# EAGLE design doorbell-hardware (EAGLE 7.1.0)
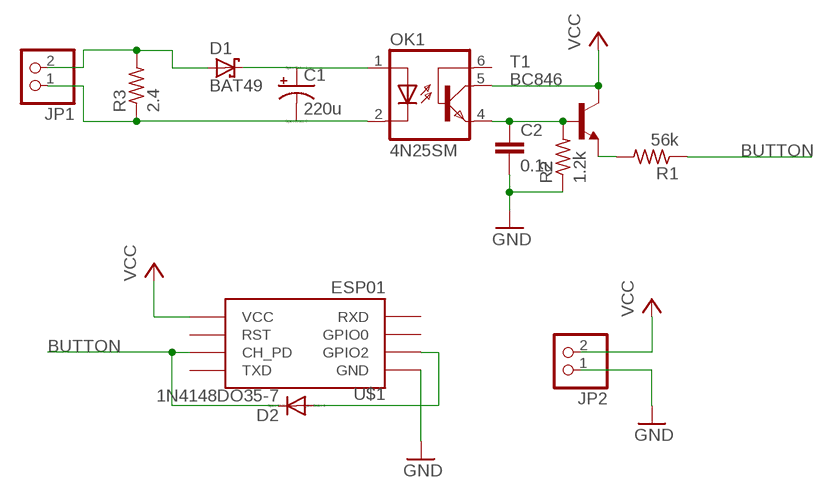
[diagram p0: schematic, sheet 1]

## Parts
C1  220u  CPOL-USE2-4  [E2-4]
C2  0.1u  C2.5/2  [C2.5-2]
D1  BAT49  [DO41-10]
D2  1N4148DO35-7  [DO35-7]
JP1  PINHD-1X2  [1X02]
JP2  PINHD-1X2  [1X02]
OK1  4N25SM  [DIL6-SMD]
R1  56k  R-US_0204/5  [0204/5]
R2  1.2k  R-US_0204/5  [0204/5]
R3  2.4  R-US_0613/15  [P0613/15]
T1  BC846  [SOT23]
U$1  ESP01  [ESP01]

## Nets
BUTTON: D2.C R1.1 U$1.CH_PD
GND: C2.2 JP2.1 R2.1 U$1.GND
N$1: D1.A JP1.2 R3.2
N$2: R1.2 T1.2(E)
N$3: C1.+ D1.C OK1.1(A)
N$4: C1.- JP1.1 OK1.2(C) R3.1
N$6: C2.1 OK1.4(EMI) R2.2 T1.1(B)
N$9: D2.A U$1.GPIO2
VCC: JP2.2 OK1.5(COL) T1.3(C) U$1.VCC
Unconnected: OK1.6(BAS) U$1.GPIO0 U$1.RST U$1.RX(RXD) U$1.TX(TXD)

## Library data of the parts
C1 = resistor:CPOL-US: POLARIZED CAPACITOR, American symbol
C2 = capacitor-wima:C: CAPACITOR naming: grid - package width
D1 = diode:BAT49: DIODE small signal diode
D2 = diode:1N4148: DIODE high speed (Philips)
JP1 JP2 = pinhead:PINHD-1X2: PIN HEADER
OK1 = optocoupler:4N*?M: General Purpose 6-Pin Phototransistor Optocouplers Source: http://www.fairchildsemi.com/ds/4N/4N35-M.pdf; MF: FAIRCHILD SEMICONDUCTOR; MPN: 4N25SM; OC_FARNELL: 1021152; OC_NEWARK: 34C2020
R1-R3 = resistor:R-US_: RESISTOR, American symbol
T1 = transistor:BC846: NPN TRANSISTOR
U$1 = esp8266modules:ESP01: ESP8266 Wifi module 01

## Board
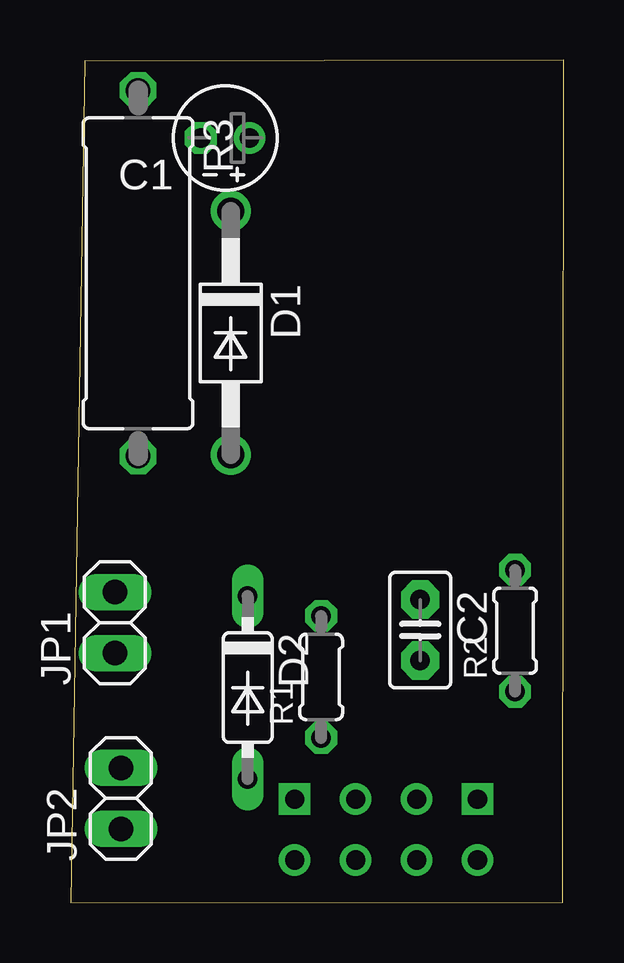
[diagram p1: board, top side]
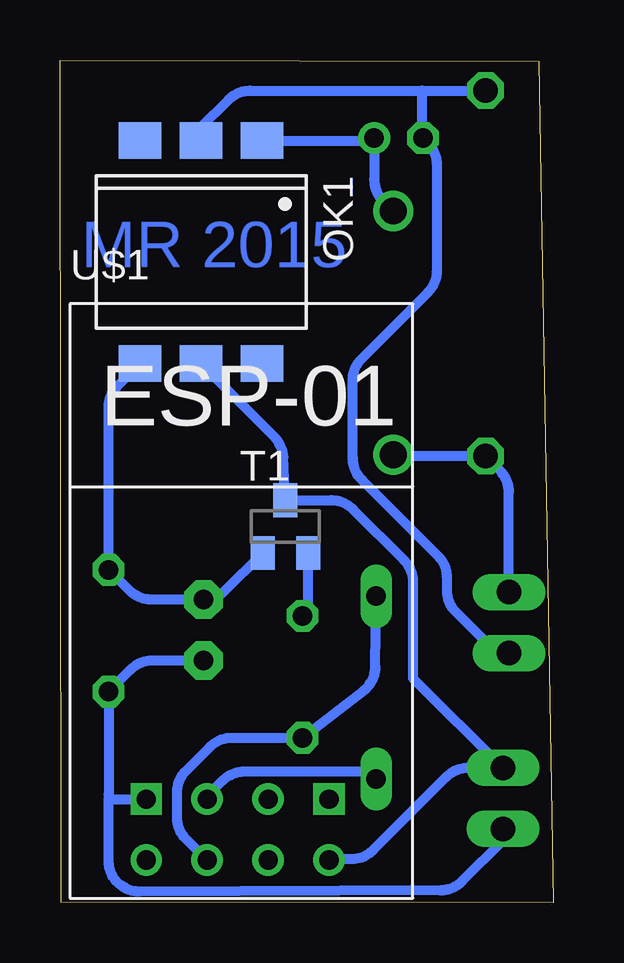
[diagram p2: board, bottom side, seen from below]

Size 20.54 x 35.11 mm. Coordinates in mm from the lower left corner, seen from the top.
Outline: 0,0 20.5,0.01 20.54,35.11 0.59,35.06 0,0
Copper layers (1*16): Top 0.035mm / dielectric 1.5mm / Bottom 0.035mm
Design rules "default": minimum track width 10mil, minimum drill 24mil, track to track 8mil, track to pad 8mil, pad to pad 8mil, via to via 8mil, smd to smd 8mil, copper to edge 40mil, drill to drill 8mil, minimum pad ring 10mil, minimum via ring 8mil, stop-mask expansion 4mil, vias tented up to drill 0mil, thermal gap 10mil

### Footprints (pad centres in the part's own frame; a part is rotated, then mirrored left to right if it is on the bottom)
E2-4 = drill 0.813 pad 1.27: + -1.016,0 | drill 0.813 pad 1.27 octagon: - 1.016,0
C2.5-2 = drill 0.813 pad 1.6 octagon: 1 -1.27,0; 2 1.27,0
DO41-10 = drill 1.118: A 5.08,0; C -5.08,0
DO35-7 = drill 0.813 long: A 3.81,0; C -3.81,0
1X02 = drill 1.016 long: 1 -1.27,0; 2 1.27,0
DIL6-SMD = smd 1.78 x 1.52: 1 -2.54,-4.645; 2 0,-4.645; 3 2.54,-4.645; 4 2.54,4.645; 5 0,4.645; 6 -2.54,4.645
0204/5 = drill 0.813 octagon: 1 -2.54,0; 2 2.54,0
P0613/15 = drill 1.016 octagon: 1 -7.62,0; 2 7.62,0
SOT23 = smd 1 x 1.4: 1 -0.95,-1.1; 2 0.95,-1.1; 3 0,1.1
ESP01 = drill 0.8: CH_PD -1.285,-8.178; GPIO0 1.255,-5.638; GPIO2 -1.285,-5.638; RST 1.255,-8.178; TX -3.825,-8.178; VCC 3.795,-8.178 | drill 0.8 square: GND -3.825,-5.638; RX 3.795,-5.638

### Placement (x,y rotation side)
C1  6.44,31.86 180 top
C2  14.56,11.35 270 top
D1  6.66,23.73 270 top
D2  7.37,8.96 270 top
JP1  1.84,11.66 90 top
JP2  2.09,4.34 90 top
OK1  14.67,27.11 180 bottom
R1  10.43,9.4 90 top
R2  18.52,11.33 90 top
R3  2.81,26.22 270 top
T1  11.15,15.66 0 bottom
U$1  13.13,9.95 0 bottom

### Tracks (layer width: path | path; a pad name or v marks a point on that pad's centre or on a via)
BUTTON
  Bottom 0.406: D2.C 7.4,9.83 arc52 7.89,8.83 R1.1 13.39,6.87 arc-45 14.29,6.49 15.29,5.49 arc-45 15.66,4.59 15.66,3.55 arc-45 15.29,2.65 U$1.CH_PD
GND
  Bottom 0.406: C2.2 16.69,10.08 arc-45 17.59,9.71 R2.1 18.52,4.51 18.52,4.31 | 18.52,4.31 U$1.GND | JP2.1 2.09,2.58 3.79,0.88 arc45 4.69,0.51 17.24,0.46 arc90 18.52,1.73 18.52,4.31
N$1
  Bottom 0.406: D1.A 6.61,18.6 R3.2 2.21,18.01 arc45 1.84,17.11 JP1.2
N$2
  Bottom 0.406: R1.2 arc-45 10.2,12.5 T1.2
N$3
  Bottom 0.406: OK1.1 7.71,31.75 arc-45 C1.+ 7.45,30.13 arc-45 7.08,29.23 D1.C
N$4
  Bottom 0.406: OK1.2 14.67,32.31 13.52,33.46 arc45 12.62,33.83 5.45,33.83 | 5.45,33.83 R3.1 | JP1.1 arc45 2.68,10.74 4.04,12.1 arc45 4.41,13 4.41,13.54 arc-45 4.78,14.43 7.97,17.62 arc45 8.34,18.52 8.34,21.77 arc45 7.97,22.67 5.2,25.43 arc-45 4.83,26.33 4.83,30.74 arc-45 5.2,31.64 C1.- arc90 5.45,31.89 5.45,33.83
N$6
  Bottom 0.406: T1.1 13.68,12.99 arc45 C2.1 16.75,12.62 arc45 17.65,13 R2.2 18.52,20.63 arc45 18.14,21.53 OK1.4
N$9
  Bottom 0.406: U$1.GPIO2 14.41,4.43 13.75,5.09 arc45 12.86,5.46 7.69,5.46 D2.A
VCC
  Bottom 0.406: OK1.5 11.61,19.4 arc42 11.24,18.56 T1.3 9.24,16.76 arc45 8.34,16.39 6.21,14.26 arc45 5.83,13.36 5.83,9.35 JP2.2 3.55,5.61 arc-45 4.44,5.23 7.5,2.18 arc45 8.4,1.81 9.29,1.81 U$1.VCC

### Text on the board
Bottom: MR 2015